# Altium schematic sheet Microcontroller_8051_2.SchDoc
size A
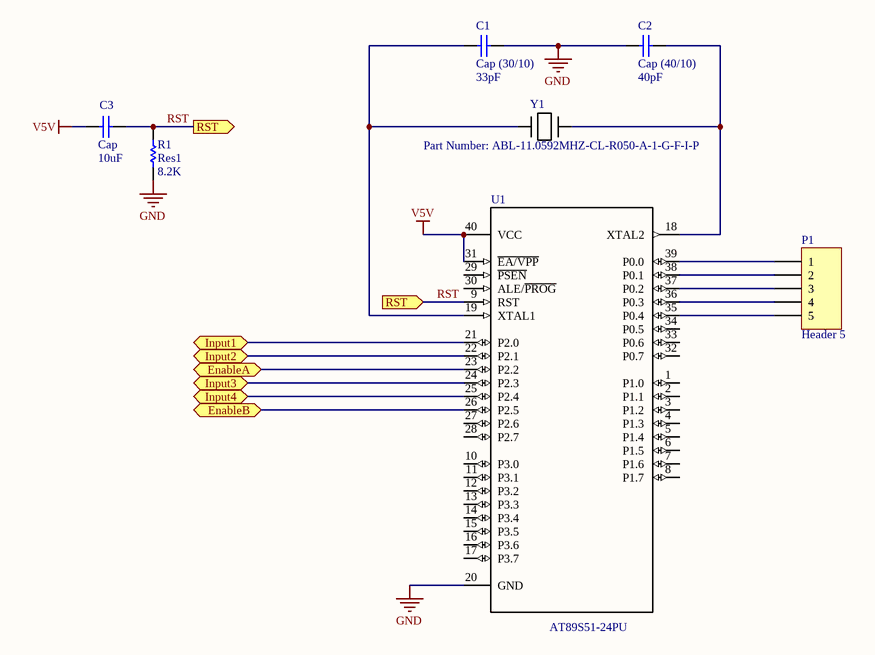
[diagram p0: Microcontroller_8051_2.SchDoc]

## Parts
C1  Cap (30/10)  value 33pF  [RAD-0.3]
C2  Cap (40/10)  value 40pF  [RAD-0.3]
C3  Cap  value 10uF  [RAD-0.3]
P1  Header 5  [HDR1X5]
R1  Res1  value 8.2K  [AXIAL-0.3]
U1  AT89S51-24PU  [DIP254P1524X482-40]
Y1  Part Number: ABL-11.0592MHZ-CL-R050-A-1-G-F-I-P  [ABL_Series]

## Ports
EnableA, EnableB, Input1, Input2, Input3, Input4, RST (in), RST (out)

## Nets
GND: C1.2 C2.1 R1.2 U1.20(GND)
V5V: C3.2 U1.31(~{EA/VPP}) U1.40(VCC)
EnableA: U1.23(P2.2) ; port EnableA
EnableB: U1.26(P2.5) ; port EnableB
Input1: U1.21(P2.0) ; port Input1
Input2: U1.22(P2.1) ; port Input2
Input3: U1.24(P2.3) ; port Input3
Input4: U1.25(P2.4) ; port Input4
RST: C3.1 R1.1 U1.9(RST) ; port RST
NetC1_1: C1.1 U1.19(XTAL1) Y1.1
NetC2_2: C2.2 U1.18(XTAL2) Y1.2
NetP1_1: P1.1 U1.39(P0.0)
NetP1_2: P1.2 U1.38(P0.1)
NetP1_3: P1.3 U1.37(P0.2)
NetP1_4: P1.4 U1.36(P0.3)
NetP1_5: P1.5 U1.35(P0.4)

Not connected (* = marked no-connect by the designer): U1 1(P1.0) 2(P1.1) 3(P1.2) 4(P1.3) 5(P1.4) 6(P1.5) 7(P1.6) 8(P1.7) 10(P3.0) 11(P3.1) 12(P3.2) 13(P3.3) 14(P3.4) 15(P3.5) 16(P3.6) 17(P3.7) 27(P2.6) 28(P2.7) 29(~{PSEN}) 30(ALE/~{PROG}) 32(P0.7) 33(P0.6) 34(P0.5)

## Library data of the parts
C1-C3 = Cap: Capacitor; Published: 8-Jun-2000; LatestRevisionDate: 17-Jul-2002; LatestRevisionNote: Re-released for DXP Platform.; PackageReference: RAD-0.3; Publisher: Altium Limited; PackageDescription: Radial Cap, Thru-Hole; 2 Leads; 0.3 in Pin Spacing
P1 = Header 5: Header, 5-Pin; LatestRevisionDate: 17-Jul-2002; LatestRevisionNote: Re-released for DXP Platform.; Publisher: Altium Limited
R1 = Res1: Resistor; Published: 8-Jun-2000; LatestRevisionDate: 17-Jul-2002; LatestRevisionNote: Re-released for DXP Platform.; PackageReference: AXIAL-0.3; Publisher: Altium Limited; PackageDescription: Axial Device, Thru-Hole; 2 Leads; 0.3 in Pin Spacing
U1 = AT89S51-24PU: AT89S Series 24 MHz 4 KB Flash 128 B SRAM 8-Bit Microcontroller - DIP-40; MF: Microchip; Package: DIP-40 Microchip; MP: AT89S51-24PU; Digi-Key_Purchase_URL: https://www.digikey.in/product-detail/en/microchip-technology/AT89S51-24PU/AT89S51-24PU-ND/1118891?utm_source=snapeda&utm_medium=aggregator&utm_campaign=symbol; SnapEDA_Link: https://www.snapeda.com/parts/AT89S51-24PU/Microchip/view-part/?ref=snap; Digi-Key_Part_Number: AT89S51-24PU-ND; Value: *
Y1 = ABL-11.0592MHZ-C: No Description Available; Vendor: Abracon; Built_By: EMA_UL_Team; Manufacturer_Part_Number: ABL-11.0592MHZ-CL-R050-A-1-G-F-I-P; Copyright: Copyright (C) 2018 Accelerated Designs. All rights reserved; RefDes: RefDes; Type: DEV; Value: Value